# EAGLE design Board (EAGLE 9.6.2)
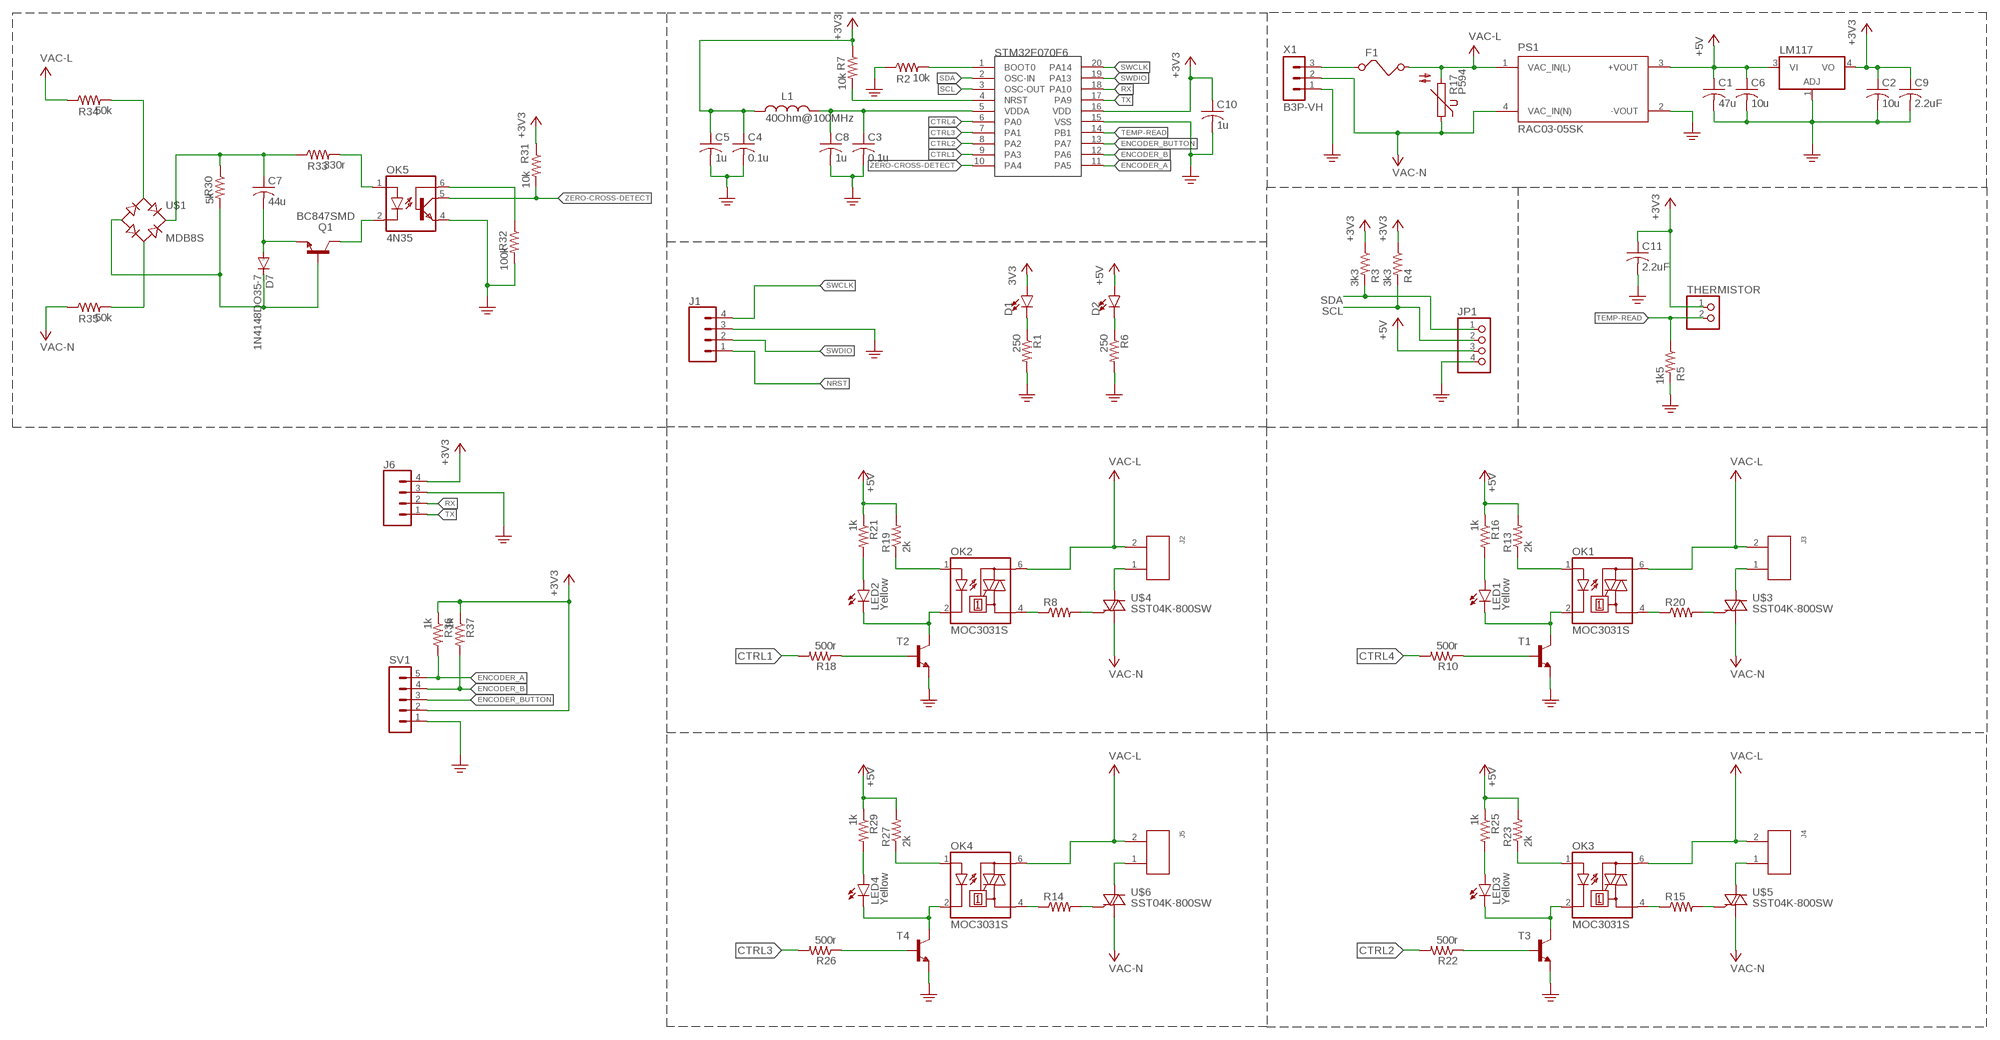
[diagram p0: schematic, sheet 1]

## Parts
C1  47u  C-USC0603  [C0603]
C2  10u  C-USC0603  [C0603]
C3  0.1u  C-USC0603  [C0603]
C4  0.1u  C-USC0603  [C0603]
C5  1u  C-USC0603  [C0603]
C6  10u  C-USC0603  [C0603]
C7  44u  C-USC0603  [C0603]
C8  1u  C-USC0603  [C0603]
C9  2.2uF  C-USC0603  [C0603]
C10  1u  C-USC0603  [C0603]
C11  2.2uF  C-USC0603  [C0603]
D1  LED0603  [LED-0603]
D2  LED0603  [LED-0603]
D7  1N4148DO35-7  [DO35-7]
F1  FUSE  [FUSE]
J1  CONN_04  [1X04]
J2  66100211622  [66100211622]
J3  66100211622  [66100211622]
J4  66100211622  [66100211622]
J5  66100211622  [66100211622]
J6  CONN_04  [1X04]
JP1  PINHD-1X4  [1X04]
L1  40Ohm@100MHz  WE-CBF_0805_74279208_WB_HS  [WE-CBF_0805(W=3.0)]
LED1  Yellow  LED-YELLOW0603  [LED-0603]
LED2  Yellow  LED-YELLOW0603  [LED-0603]
LED3  Yellow  LED-YELLOW0603  [LED-0603]
LED4  Yellow  LED-YELLOW0603  [LED-0603]
LM117  317EMP  [SOT223]
OK1  MOC3031S  [DIL6-SMD]
OK2  MOC3031S  [DIL6-SMD]
OK3  MOC3031S  [DIL6-SMD]
OK4  MOC3031S  [DIL6-SMD]
OK5  4N35  [DIL06]
PS1  RAC03-05SK  [CONV_RAC03-05SK]
Q1  BC847SMD  [SOT23]
R1  250  R-US_R0603  [R0603]
R2  10k  R-US_R0603  [R0603]
R3  3k3  R-US_R0603  [R0603]
R4  3k3  R-US_R0603  [R0603]
R5  1k5  R-US_R0603  [R0603]
R6  250  R-US_R0603  [R0603]
R7  10k  R-US_R0603  [R0603]
R8  R-US_0613/15  [P0613/15]
R10  500r  R-US_R0603  [R0603]
R13  2k  R-US_R0603  [R0603]
R14  R-US_0613/15  [P0613/15]
R15  R-US_0613/15  [P0613/15]
R16  1k  R-US_R0603  [R0603]
R17  P594  [P594]
R18  500r  R-US_R0603  [R0603]
R19  2k  R-US_R0603  [R0603]
R20  R-US_0613/15  [P0613/15]
R21  1k  R-US_R0603  [R0603]
R22  500r  R-US_R0603  [R0603]
R23  2k  R-US_R0603  [R0603]
R25  1k  R-US_R0603  [R0603]
R26  500r  R-US_R0603  [R0603]
R27  2k  R-US_R0603  [R0603]
R29  1k  R-US_R0603  [R0603]
R30  5k  R-US_R0603  [R0603]
R31  10k  R-US_R0603  [R0603]
R32  100k  R-US_R0603  [R0603]
R33  330r  R-US_R0603  [R0603]
R34  50k  R-US_R0603  [R0603]
R35  50k  R-US_R0603  [R0603]
R36  1k  R-US_R0603  [R0603]
R37  1k  R-US_R0603  [R0603]
STM32F070F6  STM32F07  [TSSOP20]
SV1  MA05-1  [MA05-1]
T1  -NPN-SOT23-EBC  [SOT23-EBC]
T2  -NPN-SOT23-EBC  [SOT23-EBC]
T3  -NPN-SOT23-EBC  [SOT23-EBC]
T4  -NPN-SOT23-EBC  [SOT23-EBC]
THERMISTOR  PINHD-1X2  [1X02]
U$1  MDB8S  [4-MICRODIP]
U$3  SST04K-800SW  [DPAK]
U$4  SST04K-800SW  [DPAK]
U$5  SST04K-800SW  [DPAK]
U$6  SST04K-800SW  [DPAK]
X1  B3P-VH  [B3P-VH]

## Nets
+3V3: C2.1 C4.1 C5.1 C9.1 C10.1 C11.1 D1.A J6.4 L1.1 LM117.4(VO) R3.1 R4.1 R7.1 R31.1 R36.1 R37.1 STM32F070F6.16(VDD) SV1.2 THERMISTOR.1 ; supply symbol labelled 3V3
+5V: C1.1 C6.1 D2.A JP1.3 LM117.3(VI) PS1.3(+VOUT) R13.2 R16.1 R19.2 R21.1 R23.2 R25.1 R27.2 R29.1
CTRL1: R18.2 STM32F070F6.9(PA3)
CTRL2: R22.2 STM32F070F6.8(PA2)
CTRL3: R26.2 STM32F070F6.7(PA1)
CTRL4: R10.2 STM32F070F6.6(PA0)
ENCODER_A: R36.2 STM32F070F6.11(PA5) SV1.5
ENCODER_B: R37.2 STM32F070F6.12(PA6) SV1.4
ENCODER_BUTTON: STM32F070F6.13(PA7) SV1.3
FET1: R18.1 T2.B
FET2: R22.1 T3.B
FET3: R10.1 T1.B
FET4: R26.1 T4.B
N$1: D1.C R1.1
N$2: D2.C R6.1
N$3: C3.1 C8.1 L1.2 STM32F070F6.5(VDDA)
N$4: LED2.C OK2.2(C) T2.C
N$5: LED1.C OK1.2(C) T1.C
N$7: OK1.4(A1) R20.1
N$8: OK1.1(A) R13.1
N$9: R20.2 U$3.3(G)
N$10: LED1.A R16.2
N$11: J3.1 U$3.4(A2)
N$12: OK2.1(A) R19.1
N$13: OK2.4(A1) R8.1
N$14: R8.2 U$4.3(G)
N$15: LED2.A R21.2
N$16: J2.1 U$4.4(A2)
N$17: LED3.C OK3.2(C) T3.C
N$18: OK3.1(A) R23.1
N$20: OK3.4(A1) R15.1
N$23: R15.2 U$5.3(G)
N$24: LED3.A R25.2
N$25: J4.1 U$5.4(A2)
N$26: LED4.C OK4.2(C) T4.C
N$27: OK4.1(A) R27.1
N$28: OK4.4(A1) R14.1
N$29: R14.2 U$6.3(G)
N$30: LED4.A R29.2
N$31: J5.1 U$6.4(A2)
N$32: D7.C Q1.1(B) R30.2 U$1.4(-)
N$33: C7.1 R30.1 R33.1 U$1.3(+)
N$34: C7.2 D7.A Q1.2(E)
N$35: OK5.2(C) Q1.3(C)
N$36: OK5.6(BAS) R32.1
N$37: OK5.1(A) R33.2
N$38: R34.2 U$1.1(AC1)
N$39: R35.2 U$1.2(AC2)
N$43: R2.2 STM32F070F6.1(BOOT0)
NRST: J1.1 R7.2 STM32F070F6.4(NRST)
PE: C1.2 C2.2 C3.2 C4.2 C5.2 C6.2 C8.2 C9.2 C10.2 C11.2 J1.3 J6.3 JP1.4 LM117.1(ADJ) OK5.4(EMI) PS1.2(-VOUT) R1.2 R2.1 R5.2 R6.2 R32.2 STM32F070F6.15(VSS) SV1.1 T1.E T2.E T3.E T4.E X1.1
RX: J6.2 STM32F070F6.18(PA10)
SCL: JP1.2 R4.2 STM32F070F6.3(OSC-OUT)
SDA: JP1.1 R3.2 STM32F070F6.2(OSC-IN)
SWCLK: J1.4 STM32F070F6.20(PA14)
SWDIO: J1.2 STM32F070F6.19(PA13)
TEMP-READ: R5.1 STM32F070F6.14(PB1) THERMISTOR.2
TX: J6.1 STM32F070F6.17(PA9)
V+: F1.2 J2.2 J3.2 J4.2 J5.2 OK1.6(A2) OK2.6(A2) OK3.6(A2) OK4.6(A2) PS1.1(VAC_IN(L)) R17.2 R34.1 ; supply symbol labelled VAC-L
V-: PS1.4(VAC_IN(N)) R17.1 R35.1 U$3.1(A1) U$4.1(A1) U$5.1(A1) U$6.1(A1) X1.2 ; supply symbol labelled VAC-N
VAC(L)-INPUT: F1.1 X1.3
ZERO-CROSS-DETECT: OK5.5(COL) R31.2 STM32F070F6.10(PA4)

## Library data of the parts
C1-C11 = rcl:C-US: CAPACITOR, American symbol; SPICEPREFIX: C
D1 D2 = SparkFun-LED:LED: LED (Generic) Standard schematic elements and footprints for 5mm, 3mm, 1206, and 0603 sized LEDs. Generic LEDs with no color specified.
D7 = diode:1N4148: DIODE high speed (Philips)
F1 = special:FUSE: FUSE 5 x 20 mm
J1 J6 = SparkFun-Connectors:CONN_04: Multi connection point. Often used as Generic Header-pin footprint for 0.1 inch spaced/style header connections On any of the 0.1 inch spaced packages, you can populate with these: Break Away Headers - Straight <https://www.sparkfun.com/products/116> (PRT-00116) Break Away Male Headers - Right Angle <https://www.sparkfun.com/products/553> (PRT-00553) Female Headers <https://www.sparkfun.com/products/115> (PRT-00115) Break Away Headers - Machine Pin <https://www.sparkfun.com/products/117> (PRT-00117) Break Away Female Headers - Swiss Machine Pin <https://www.sparkfun.com/products/743> (PRT-00743) For SCREWTERMINALS and SPRING TERMINALS visit here: Screw Terimnals on SparkFun.com <https://www.sparkfun.com/search/results?term=Screw+Terminals> (5mm/3.5mm/2.54mm spacing) This device is also useful as a general connection point to wire up your design to another part of your project. Our various solder wires solder well into these plated through hole pads. Hook-Up Wire - Assortment (Stranded, 22 AWG) <https://www.sparkfun.com/products/11375> (PRT-11375) Hook-Up Wire - Assortment (Solid Core, 22 AWG) <https://www.sparkfun.com/products/11367> (PRT-11367) View the entire wire category on our website here <https://www.sparkfun.com/categories/141> Special notes: Molex polarized connector foot print use with SKU : PRT-08231 with associated crimp pins and housings. 1MM SMD Version SKU: PRT-10208; PROD_ID: CONN-09696
J2-J5 = Wurth_Elektronik_Electromechanic_Wire_to_Board_Connectors_rev19a:66100211622: WIRE TO BOARD CONNECTION - 2.54 MM - SHROUDED HEADER - STRAIGHT - GLOW WIRE PLASTIC - WR-WTB =>ConWTB254 66100211622 Characteristics INSULATOR: PA46G15 FLAMMABILITY RATING: UL94V0 COLOR: BLACK METAL: PHOSPHOR BRONZE PLATING: TIN OVER Ni QUALITY CLASS: 25 MATING CYCLES OPERATING TEMPERATURE:-40°C UP TO +125°C COMPLIANCE: LEAD FREE AND ROHS ELECTRICAL CURRENT RATING: 3 A WORKING VOLTAGE: 50 VAC WITHSTANDING VOLTAGE: 500 VAC/MIN INSULATION RESISTANCE: >1000 MΩ CONTACT RESISTANCE: 20 mΩ MAX <http://katalog.we-online.de/media/images/v2/Family_WR-WTB_6610xx11622_2%2054.jpg> Details see: http://katalog.we-online.de/en/em/WTB_2_54_MALE_HORIZONTAL_SHROUDED_HEADER_GLOW_WIRE_PLASTIC_6610XXX1622 2015 (C) Wurth Elektronik
JP1 = pinhead:PINHD-1X4: PIN HEADER
L1 = Wurth_EMC Components_WE-CBF:WE-CBF_0805: WE-CBF SMD EMI Suppression Ferrite Bead Characteristics Reliable Ni-Sn electrodes High rated current up to 6 A Operating temperature: –55 ºC to +125 ºC Applications Perfect as data lined filter and for uncoupling of distribution voltage Package name and Variant abbreviation: Package: Wide Band /High Speed: W=Width= 3.0 High Current: W=Width= 4.0 Variant abbreviation: WB = Wide Band HS=High Speed HC=High Current <https://katalog.we-online.de/media/images/v2/o14753v209%20Family_WE-CBF.jpg> Details see: http://katalog.we-online.de/en/pbs/WE-CBF Updated by Ella Wu 2019-01-02 2019 (C) Wurth Elektronik; DATASHEET-URL: https://katalog.we-online.de/pbs/datasheet/74279208.pdf; IR1: 500mA; IR2: -; MOUNT: SMT; PART-NUMBER: 74279208; RDC-MAX: 0.15Ohm; TYPE: High Speed; Z: 69Ohm@1GMHz; ZMAX: 68Ohm
LED1-LED4 = SparkFun-LED:LED-YELLOW: Yellow SMD LED Used in manufacturing several products at SparkFun. Packages: 0603 - SMD 0603 package[Product Link] <http://www.kingbrightusa.com/product.asp?catalog_name=LED&product_id=APT1608SYCK> 0603 -SMART - SMART SMD 0603 package (more efficient/more expensive) [Product Link] <http://www.osram-os.com/osram_os/en/products/product-catalog/led-light-emitting-diodes/smartled-0603/ly-l29k/index.jsp> LilyPad - SMD1206 package[Product Datasheet] <https://www.sparkfun.com/datasheets/DevTools/LilyPad/Q150YUS4.pdf> SparkFun Products: Blynk Board <https://www.sparkfun.com/products/13794> IOIO-OTG <https://www.sparkfun.com/products/13613> XBee Explorer Serial <https://www.sparkfun.com/products/13225>; PROD_ID: DIO-09003
LM117 = linear:*317: Positive VOLTAGE REGULATOR
OK1-OK4 = optocoupler:MOC30*: 6-Pin DIP Zero-Cross Optoisolators Triac Driver Output (250/400 Volt Peak) Source: Data sheet <http://www.fairchildsemi.com/ds/MO/MOC3031M.pdf> The old path of data sheet not more available 2013-05-06.; MF: FAIRCHILD SEMICONDUCTOR; MPN: MOC3031SM; OC_FARNELL: unknown; OC_NEWARK: 34C1335
OK5 = optocoupler:4N35: MOTOROLA OPTO COUPLER; MF: FAIRCHILD SEMICONDUCTOR; MPN: 4N35; OC_FARNELL: 1328375; OC_NEWARK: 72K9946
PS1 = SousVide Library:RAC03-05SK: 3W AC/DC-Converter 'POWERLINE' 3kV reg; AVAILABILITY: Unavailable; DESCRIPTION: Enclosed AC DC Converters 1 Uitgang 5V 600mA 85 ~ 264 VAC, 120 ~ 370 VDC Input; MF: Recom Power; MP: RAC03-05SK; PACKAGE: DIP-4 Recom Power; PRICE: None
Q1 = SousVide Library:BC847*: NPN Transistor
R1-R8 R10 R13-R16 R18-R23 R25-R27 R29-R37 = rcl:R-US_: RESISTOR, American symbol; SPICEPREFIX: R
R17 = varistor:P594: VARISTOR
STM32F070F6 = SousVide Library:STM32F07
SV1 = con-lstb:MA05-1: PIN HEADER; OC_FARNELL: unknown; OC_NEWARK: unknown
T1-T4 = transistor:*-NPN-: NPN Transistror BF959 corrected 2008.03.06
THERMISTOR = pinhead:PINHD-1X2: PIN HEADER
U$1 = SousVide Library:MDB8S
U$3-U$6 = SousVide Library:SST04K-800SW
X1 = con-JST VH:B3P-VH: JST VH Series header 3.96mm pitch disconnectable crimp style connectors, vertical (side entry type), 3 pins

## Net classes
0 default: width 0.305 mm, drill 0.305 mm, clearance 0.254 mm

## Board
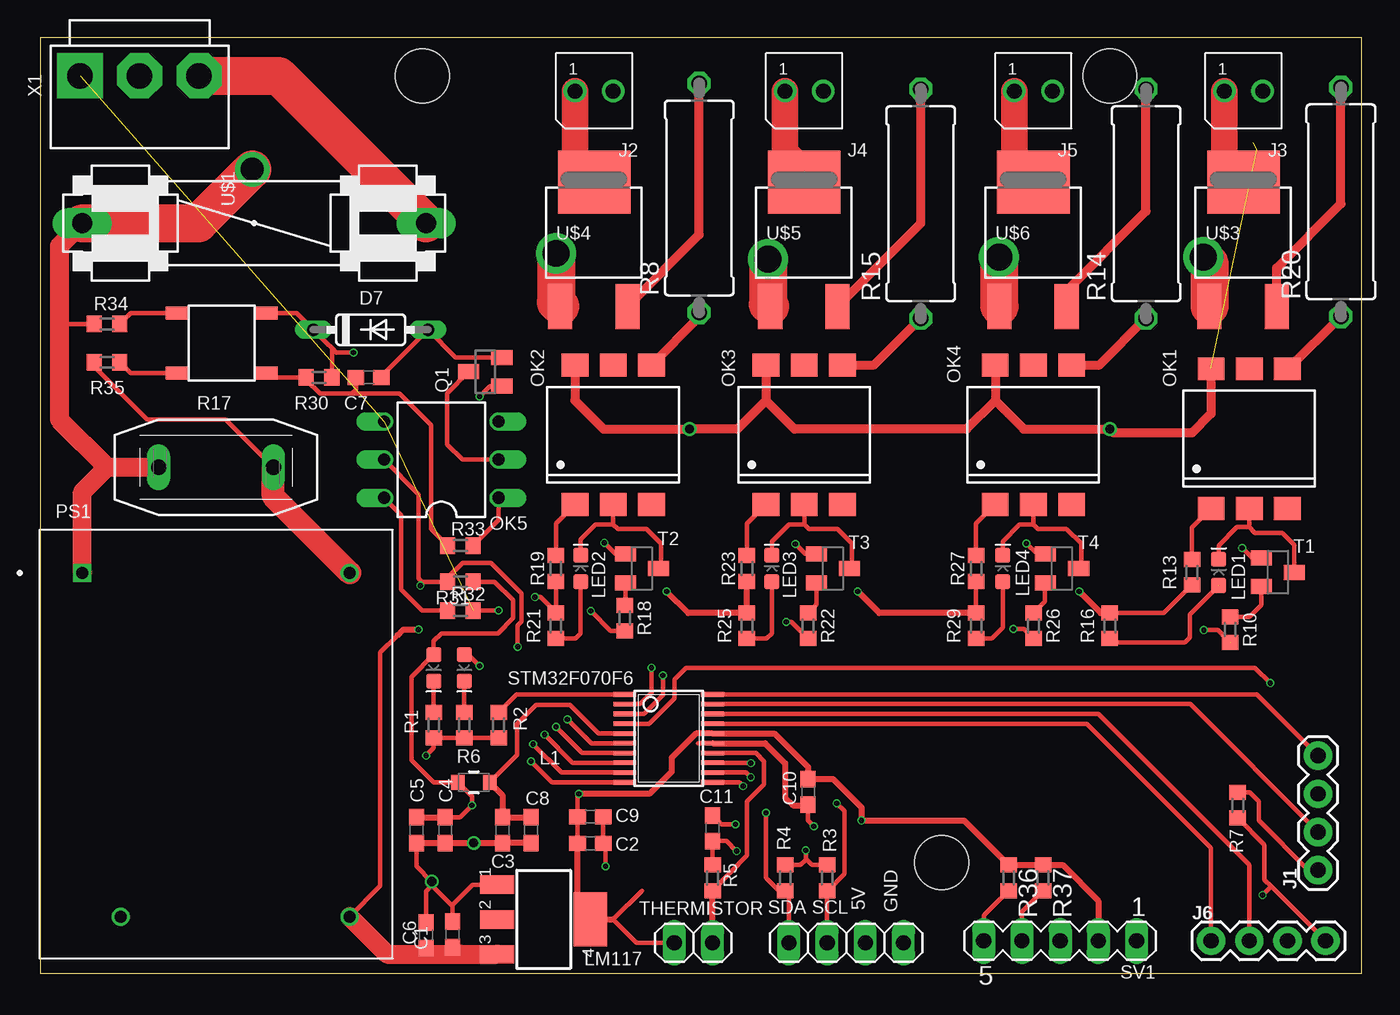
[diagram p1: board, top side]
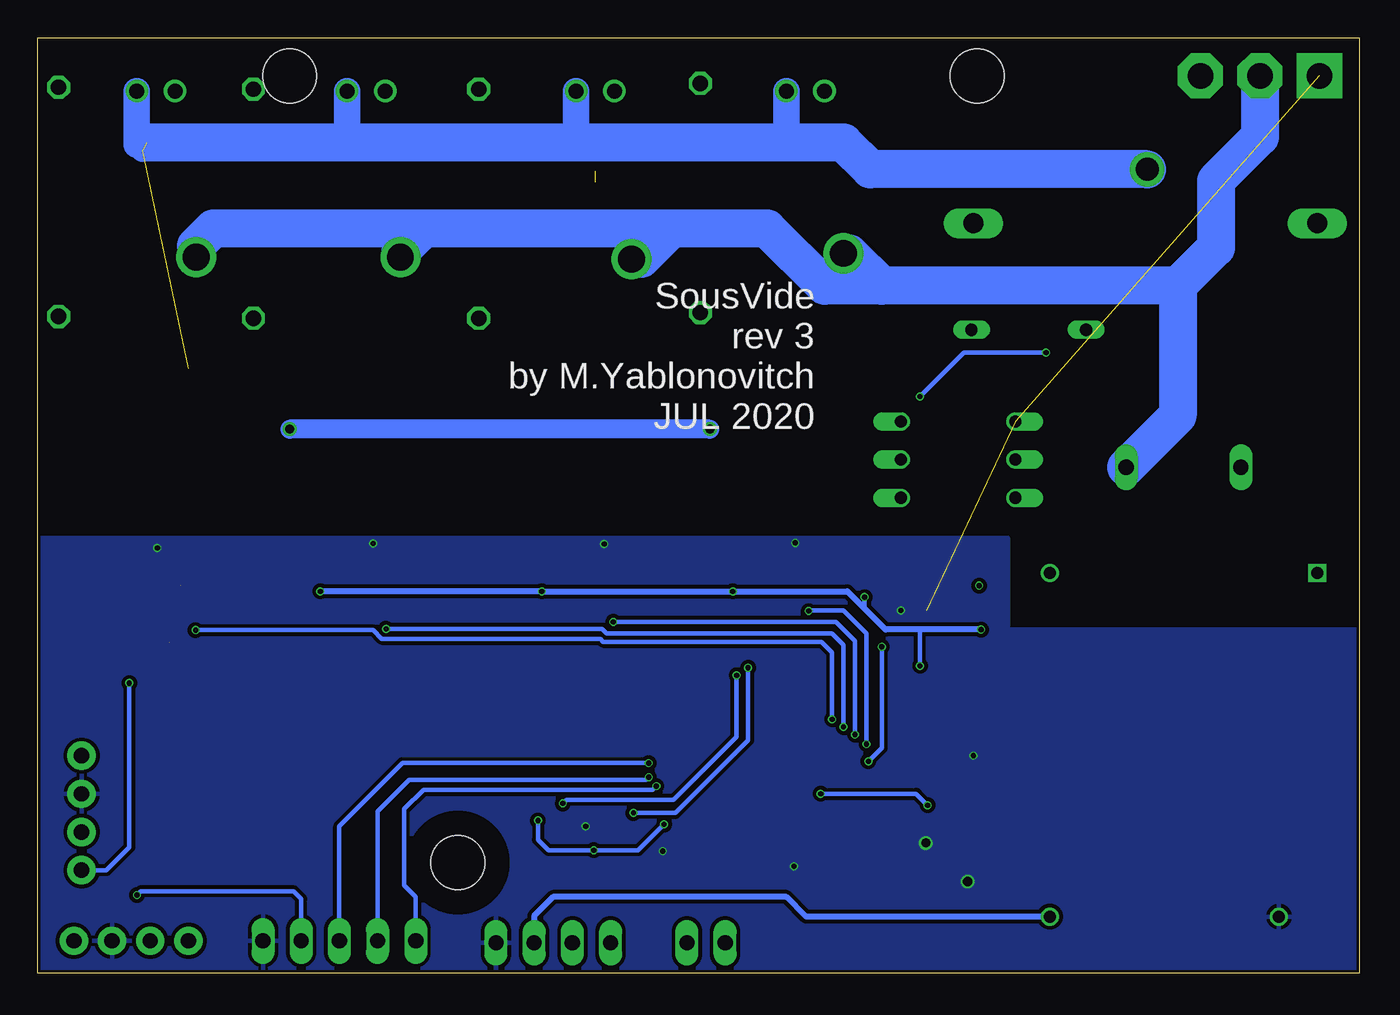
[diagram p2: board, bottom side, seen from below]

Size 87.88 x 62.23 mm. Coordinates in mm from the lower left corner, seen from the top.
Outline: 0,0 87.88,0 87.88,62.23 0,62.23 0,0
Copper layers (1*16): Top 0.035559375mm / dielectric 1.6mm / Bottom 0.035559375mm
Design rules "jlcpcb2layer *": minimum track width 5mil, minimum drill 8mil, track to track 5mil, track to pad 5mil, pad to pad 5mil, via to via 5mil, smd to smd 5mil, copper to edge 8mil, drill to drill 6mil, minimum pad ring 5mil, minimum via ring 3mil, stop-mask expansion 2.5mil, vias tented up to drill 0mil, thermal gap 10mil
Holes 3.58 mm at 71.12,59.69 25.4,59.69 59.94,7.37
bRestrict: area 22.6,56.9 to 28.2,62.5; area 68.6,57.1 to 73.7,62.2; area 57.8,5.2 to 62.1,9.5

### Footprints (pad centres in the part's own frame; a part is rotated, then mirrored left to right if it is on the bottom)
C0603 = smd 1.1 x 1: 1 -0.85,0; 2 0.85,0
LED-0603 = smd 1 x 1: A -0.877,0; C 0.877,0
DO35-7 = drill 0.813 long: A 3.81,0; C -3.81,0
FUSE = drill 1.321 long: 1 -11.43,0; 2 11.43,0
1X04 = drill 1.016 pad 1.88: 1 0,0; 2 2.54,0; 3 5.08,0; 4 7.62,0
66100211622 = drill 1: 1 1.27,0; 2 -1.27,0
1X04' = drill 1.016 long: 1 -3.81,0; 2 -1.27,0; 3 1.27,0; 4 3.81,0
WE-CBF_0805(W=3.0) = smd 0.9 x 1: 1 -1.05,0; 2 1.05,0
SOT223 = smd 1.219 x 2.235: 1 -2.311,-3.099; 2 0,-3.099; 3 2.311,-3.099 | smd 3.6 x 2.2: 4 0,3.099
DIL6-SMD = smd 1.78 x 1.52: 1 -2.54,-4.645; 2 0,-4.645; 3 2.54,-4.645; 4 2.54,4.645; 5 0,4.645; 6 -2.54,4.645
DIL06 = drill 0.813 offset: 1 -2.54,-3.81; 2 0,-3.81; 3 2.54,-3.81; 4 2.54,3.81; 5 0,3.81; 6 -2.54,3.81
CONV_RAC03-05SK = drill 0.8 pad 1.2 square: 1 -8.89,11.39 | drill 0.8 pad 1.2: 2 -6.35,-11.47; 3 8.89,-11.47; 4 8.89,11.39
SOT23 = smd 1 x 1.4: 1 -0.95,-1.1; 2 0.95,-1.1; 3 0,1.1
R0603 = smd 1 x 1.1: 1 -0.85,0; 2 0.85,0
P0613/15 = drill 1.016 octagon: 1 -7.62,0; 2 7.62,0
P594 = drill 1.016 long: 1 0,3.81; 2 0,-3.81
TSSOP20 = smd 0.305 x 1.524: 1 -2.925,-2.918; 2 -2.275,-2.918; 3 -1.625,-2.918; 4 -0.975,-2.918; 5 -0.325,-2.918; 6 0.325,-2.918; 7 0.975,-2.918; 8 1.625,-2.918; 9 2.275,-2.918; 10 2.925,-2.918; 11 2.925,2.918; 12 2.275,2.918; 13 1.625,2.918; 14 0.975,2.918; 15 0.325,2.918; 16 -0.325,2.918; 17 -0.975,2.918; 18 -1.625,2.918; 19 -2.275,2.918; 20 -2.925,2.918
MA05-1 = drill 1.016 long: 1 -5.08,0; 2 -2.54,0; 3 0,0; 4 2.54,0; 5 5.08,0
SOT23-EBC = smd 1 x 1.4: B 0.95,-1.1; C 0,1.1; E -0.95,-1.1
1X02 = drill 1.016 long: 1 -1.27,0; 2 1.27,0
4-MICRODIP = smd 0.85 x 1.55: 1 -2,-2.95; 2 2,-2.95; 3 2,2.95; 4 -2,2.95
DPAK = smd 1.6 x 2.997: 1 -2.261,-4.928; 3 2.21,-4.928 | smd 4.826 x 4.191: 4 0,3.353
B3P-VH = drill 1.7 pad 3 square: 1 -3.96,0 | drill 1.7 pad 3 octagon: 2 0,0; 3 3.96,0

### Placement (x,y rotation side)
C1  27.43,2.58 90 top
C2  36.58,8.64 0 top
C3  30.73,9.53 270 top
C4  26.92,9.53 270 top
C5  25.02,9.53 270 top
C6  25.65,2.54 90 top
C7  21.84,39.62 0 top
C8  32.64,9.53 270 top
C9  36.58,10.41 0 top
C10  51.05,12.06 270 top
C11  44.7,9.65 270 top
D1  26.16,20.32 270 top
D2  28.19,20.32 270 top
D7  21.97,42.8 0 top
F1  14.22,49.89 180 top
J1  84.96,6.86 90 top
J2  36.83,58.67 180 top
J3  80.01,58.67 180 top
J4  50.8,58.67 180 top
J5  66.04,58.67 180 top
J6  77.85,2.16 0 top
JP1  [1X04']  53.59,2.03 0 top
L1  28.83,12.7 0 top
LED1  78.36,26.67 90 top
LED2  35.94,26.92 90 top
LED3  48.64,26.92 90 top
LED4  64.01,26.92 90 top
LM117  33.48,3.58 270 top
OK1  80.39,35.56 0 top
OK2  38.1,35.81 0 top
OK3  50.8,35.81 0 top
OK4  66.04,35.81 0 top
OK5  26.67,34.16 90 top
PS1  11.68,15.24 0 top
Q1  29.59,40.01 90 top
R1  26.16,16.51 270 top
R2  30.48,16.51 90 top
R3  49.53,6.35 270 top
R4  52.32,6.35 270 top
R5  44.7,6.35 90 top
R6  28.19,16.51 270 top
R7  79.63,11.18 90 top
R8  43.81,51.56 90 top
R10  79.12,22.86 270 top
R13  76.58,26.67 270 top
R14  73.53,51.18 90 top
R15  58.55,51.18 90 top
R16  71.12,23.11 270 top
R17  11.68,33.66 270 top
R18  38.86,23.62 270 top
R19  34.29,26.92 270 top
R20  86.49,51.31 90 top
R21  34.29,23.11 270 top
R22  51.05,23.11 270 top
R23  46.99,26.92 270 top
R25  46.99,23.11 270 top
R26  66.04,23.11 270 top
R27  62.23,26.92 270 top
R29  62.23,23.11 270 top
R30  18.54,39.62 0 top
R31  27.94,26.04 180 top
R32  27.94,24.13 0 top
R33  27.94,28.45 0 top
R34  4.45,43.18 0 top
R35  4.45,40.64 0 top
R36  64.39,6.35 270 top
R37  66.67,6.35 270 top
STM32F070F6  41.79,15.62 270 top
SV1  67.82,2.16 180 top
T1  82.3,26.67 270 top
T2  40.01,26.92 270 top
T3  52.7,26.92 270 top
T4  67.94,26.92 270 top
THERMISTOR  43.43,2.03 0 top
U$1  12.06,41.91 270 top
U$3  80.01,49.28 0 top
U$4  36.83,49.28 0 top
U$5  50.8,49.28 0 top
U$6  66.04,49.28 0 top
X1  6.6,59.69 0 top

### Tracks (layer width: path | path; a pad name or v marks a point on that pad's centre or on a via)
+3V3  (via drill 0.35)
  Top 0.305: R31.1 30.23,26.04 31.44,24.82 31.44,23.63 30.43,22.61 26.68,22.61 26.16,22.1 D1.A 24.69,19.73 24.69,14.17 26.16,12.7 L1.1 28.7,11.78 v28.7,11.18 27.9,10.38 C4.1 | R4.1 51.31,7.2 50.9,7.61 v50.9,8.18 50.9,7.55 50.55,7.2 R3.1 | v35.81,11.94 35.73,11.85 C9.1 C2.1 | 40.02,5.5 38.1,3.58 39.65,2.03 THERMISTOR.1 | C11.1 45.3,9.91 v46.23,9.91 | J6.4 81.85,5.78 | 81.85,5.78 81.41,6.22 81.41,8.55 R7.1 | v81.28,5.21 81.85,5.78
  Top 0.406: C5.1 C4.1 | 38.1,3.58 LM117.4 35.73,4.43 C2.1 | v35.81,11.94 40.52,11.94 41.99,13.4 41.99,14.33 43.61,15.95 STM32F070F6.16 48.82,15.95 51.05,13.72 C10.1 52.72,12.91 54.61,11.02 v54.61,10.16 61.43,10.16 R36.1 R37.1 67.98,7.2 70.36,4.83 SV1.2
  Bottom 0.305: v35.81,11.94 29.46,11.94 v28.7,11.18 | v46.23,9.91 47.95,8.18 v50.9,8.18 53.9,8.18 54.61,8.89 v54.61,10.16 | SV1.2 70.36,4.95 70.87,5.46 81.03,5.46 v81.28,5.21
+5V  (via drill 0.35)
  Top 0.305: R21.1 34.29,24.13 | 34.29,24.13 R19.2 | R13.2 74.72,23.96 R16.1 | R29.1 R27.2 | C6.1 25.4,1.44 25.4,1.27 | C1.1 27.48,1.73 27.94,1.27 | PS1.3 22.61,5.8 22.61,21.34 23.75,22.48 | D2.A 28.46,21.2 v29.21,20.45 | 34.29,24.13 34.16,24.13 33.27,25.02 v32.89,25.02
  Top 0.406: R23.2 R25.1 43.09,23.96 v41.66,25.4 | R29.1 55.79,23.96 v54.36,25.4 | R16.1 70.52,23.96 v69.09,25.4 | 23.75,22.48 24.13,22.86 v25.15,22.86
  Top 1.27: PS1.3 23.07,1.27 25.4,1.27 27.94,1.27 LM117.3
  Bottom 0.305: 32.89,24.26 v32.89,25.02 | v29.21,20.45 29.21,22.86
  Bottom 0.406: v69.09,25.4 v54.36,25.4 v41.66,25.4 34.04,25.4 32.89,24.26 31.5,22.86 29.21,22.86 v25.15,22.86 | PS1.3 36.79,3.77 38.1,5.08 53.59,5.08 54.86,3.81 JP1.3
CTRL1  (via drill 0.35)
  Top 0.305: STM32F070F6.9 34.66,13.35 v32.77,15.24 | v36.61,24.09 37.93,22.77 R18.2
  Bottom 0.305: v32.77,15.24 32.77,22.61 34.29,24.13 36.58,24.13 v36.61,24.09
CTRL2  (via drill 0.35)
  Top 0.305: STM32F070F6.8 35.4,14 v33.53,15.88 | R22.2 49.95,23.37 v49.6,23.37
  Bottom 0.305: v33.53,15.88 33.53,22.1 34.8,23.37 v49.6,23.37
CTRL3  (via drill 0.35)  (1 unrouted)
  Top 0.305: STM32F070F6.7 36.02,14.65 v34.29,16.38 | R26.2 65.4,22.91 v64.72,22.91
  Bottom 0.305: v34.29,16.38 34.29,21.84 35.05,22.61 50.04,22.61 50.34,22.91 v64.72,22.91
CTRL4  (via drill 0.35)  (2 unrouted)
  Top 0.305: STM32F070F6.6 36.64,15.3 v35.05,16.89 | R10.2 78.31,22.82 v77.38,22.82
  Bottom 0.305: v35.05,16.89 35.05,21.34 35.76,22.05 50.27,22.05 50.47,22.24 64.99,22.24 65.58,22.82 v77.38,22.82
ENCODER_A  (via drill 0.35)
  Top 0.305: SV1.5 62.74,3.85 R36.2 | STM32F070F6.11 46.48,12.7 v46.74,12.45
  Bottom 0.305: v46.74,12.45 46.99,12.19 62.23,12.19 63.5,10.92 63.5,8.88 63.52,8.85 63.52,5.87 62.74,5.08 SV1.5
ENCODER_B  (via drill 0.35)
  Top 0.305: SV1.4 65.28,4.1 R37.2 | STM32F070F6.12 46.94,13.35 v47.24,13.04
  Bottom 0.305: v47.24,13.04 47.42,12.86 63.18,12.86 63.42,12.62 63.75,12.29 65.28,10.76 SV1.4
ENCODER_BUTTON  (via drill 0.35)
  Top 0.305: STM32F070F6.13 47.23,14 v47.25,13.98
  Bottom 0.305: SV1.3 67.82,9.78 63.62,13.98 v47.25,13.98
FET1
  Top 0.305: T2.B 38.91,24.52 R18.1
FET2
  Top 0.305: R22.1 51.6,24.52 T3.B
FET3
  Top 0.305: T1.B 81.2,24.51 80.39,23.71 R10.1
FET4
  Top 0.305: T4.B 66.79,25.92 66.79,24.71 R26.1
N$1
  Top 0.305: R1.1 D1.C
N$2
  Top 0.305: R6.1 D2.C
N$3
  Top 0.305: STM32F070F6.5 37.14,15.95 35.22,17.86 32.98,17.86 31.69,16.58 31.69,14.51 L1.2
  Top 0.406: L1.2 30.73,11.85 C3.1 C8.1
N$4
  Top 0.305: OK2.2 38.1,29.84 | 38.1,29.84 38.4,29.54 40.31,29.54 41.27,28.57 41.27,27.09 T2.C | 38.1,29.84 36.93,29.84 35.94,28.86 LED2.C
N$5
  Top 0.305: T1.C 83.4,28.49 82.6,29.29 80.77,29.29 80.39,29.67 | 80.39,29.67 OK1.2 | LED1.C 78.36,28.45 79.58,29.67 80.39,29.67
N$7
  Top 0.61: OK1.4 83,40.2 R20.1
N$8
  Top 0.305: R13.1 76.58,29.64 OK1.1
N$9
  Top 0.61: U$3.3 82.22,46.91 86.49,51.18 R20.2
N$10  (1 unrouted)
  Top 0.305: R16.2 71.37,22.01 76.11,22.01 76.45,22.35 76.45,23.88 LED1.A
N$11
  Top 1.778: J3.1 78.74,53.9 U$3.4
N$12
  Top 0.305: R19.1 34.29,29.9 OK2.1
N$13
  Top 0.61: OK2.4 43.81,43.63 R8.1
N$14
  Top 0.61: U$4.3 43.81,49.12 R8.2
N$15
  Top 0.305: R21.2 35.6,22.26 35.94,22.61 LED2.A
N$16
  Top 1.778: J2.1 35.56,53.9 U$4.4
N$17
  Top 0.305: OK3.2 50.8,29.84 | 50.8,29.84 51.1,29.54 53.01,29.54 53.98,28.57 53.98,27.09 T3.C | LED3.C 48.64,28.7 49.78,29.84 50.8,29.84
N$18
  Top 0.305: R23.1 46.99,29.9 OK3.1
N$20
  Top 0.61: OK3.4 55.45,40.46 R15.1
N$23
  Top 0.61: U$5.3 58.55,49.89 R15.2
N$24
  Top 0.305: R25.2 48.3,22.26 48.64,22.61 LED3.A
N$25  (1 unrouted)
  Top 1.778: J4.1 49.53,54.61 50.8,53.34
N$26
  Top 0.305: OK4.2 66.04,29.84 | 66.04,29.84 66.34,29.54 68.25,29.54 69.22,28.57 69.22,27.09 T4.C | LED4.C 64.01,28.73 65.12,29.84 66.04,29.84
N$27
  Top 0.305: R27.1 62.23,29.9 OK4.1
N$28
  Top 0.61: OK4.4 70.43,40.46 R14.1
N$29
  Top 0.61: U$6.3 68.25,45.39 73.53,50.67 R14.2
N$30
  Top 0.305: R29.2 63.28,22.26 64.01,22.99 LED4.A
N$31
  Top 1.778: J5.1 64.77,53.9 U$6.4
N$32  (via drill 0.35)
  Top 0.305: U$1.4 17.05,43.91 D7.C 19.05,41.91 19.39,41.57 | 19.39,41.57 R30.2 | 19.39,41.57 19.68,41.27 v20.83,41.27 | v29.21,38.35 29.91,39.05 Q1.1
  Bottom 0.305: v20.83,41.27 26.29,41.27 v29.21,38.35
N$33
  Top 0.305: U$1.3 15.3,39.62 R30.1 17.69,39.46 18.61,38.54 20.7,38.54 | R33.1 25.98,29.55 25.98,36.45 23.89,38.54 20.7,38.54 | C7.1 20.99,38.83 20.7,38.54
N$34
  Top 0.305: Q1.2 27.62,40.95 D7.A 22.69,39.71 C7.2
N$35
  Top 0.305: Q1.3 27.05,38.56 27.05,35.18 28.07,34.16 OK5.2
N$36
  Top 0.305: OK5.6 24,30.48 24,25.53 25.4,24.13 R32.1
N$37
  Top 0.305: R33.2 30.48,30.14 OK5.1
N$38
  Top 0.305: R34.2 6.03,43.91 U$1.1
N$39
  Top 0.305: R35.2 6.03,39.91 U$1.2
N$43
  Top 0.305: STM32F070F6.1 31.67,18.55 R2.2
NRST  (via drill 0.35)
  Top 0.305: STM32F070F6.4 40.48,16.6 42.16,18.29 42.16,19.56 42.93,20.32 80.77,20.32 v81.79,19.3 | J1.1 84.33,6.86 81.03,10.16 81.03,11.43 80.43,12.03 R7.2
  Bottom 0.305: v81.79,19.3 81.79,8.38 83.31,6.86 J1.1
PE  (via drill 0.35, 0.6, 0.61)  (3 unrouted)
  Top 0.305: R32.2 v30.48,24.13 | LM117.1 28.75,5.89 27.43,4.57 27.43,4.45 | C1.2 27.43,4.45 | 26.04,5.84 27.43,4.45 | C6.2 25.65,5.46 26.04,5.84 | 26.04,5.84 v26.04,6.1 25.02,7.11 C5.2 | 37.51,10.5 C9.2 C2.2 37.59,8.47 v37.59,7.11 | R2.1 R6.2 R1.2 26.16,14.99 v25.65,14.48 | T4.E 66.29,27.87 v65.58,28.59 | T1.E 80.59,27.62 v79.92,28.29 | T3.E 50.88,27.87 v50.2,28.55 | T2.E 38.26,27.87 v37.51,28.63 | R5.2 C11.2 45.64,8.8 v46.31,8.13 | STM32F070F6.15 43.75,15.3 | C10.2 51.05,10.16 v51.44,9.78
  Top 0.406: C5.2 C4.2 v28.83,8.68 C3.2 C8.2 | STM32F070F6.15 48.2,15.3 49.53,13.97 49.53,11.68 50.04,11.18 51.02,11.18 C10.2
  pour Bottom: -2.54,-1.27 -2.54,22.86 23.37,22.86 23.37,28.96 89.28,28.96 89.28,-1.27
RX
  Top 0.305: STM32F070F6.18 70.36,17.25 80.39,7.22 J6.2
SCL  (via drill 0.35)
  Top 0.305: STM32F070F6.3 40.13,17.25 41.4,18.52 v41.4,19.81 | v52.96,11.3 53.47,10.79 53.47,6.6 52.36,5.5 R4.2 JP1.2
  Bottom 0.305: v41.4,19.81 41.4,15.73 45.59,11.55 52.71,11.55 v52.96,11.3
SDA  (via drill 0.35)
  Top 0.305: v40.64,20.32 40.64,18.66 39.88,17.9 STM32F070F6.2 | JP1.1 49.78,5.25 R3.2 49.11,5.5 48.26,6.35 v48.26,10.67
  Bottom 0.305: v40.64,20.32 40.64,15.49 45.47,10.67 v48.26,10.67
SWCLK
  Top 0.305: STM32F070F6.20 80.89,18.55 J1.4
SWDIO
  Top 0.305: J1.2 76.46,17.9 STM32F070F6.19
TEMP-READ
  Top 0.305: R5.1 46.98,7.85 46.98,11.42 48.13,12.57 48.13,14.1 47.58,14.65 STM32F070F6.14
  Top 0.406: THERMISTOR.2 R5.1
TX
  Top 0.305: STM32F070F6.17 69.6,16.6 77.85,8.35 J6.1
V+  (via drill 0.61, 1.52)  (3 unrouted)
  Top 0.305: R34.1 1.27,43.18
  Top 0.61: OK4.6 63.5,38.1 | 63.5,38.1 65.41,36.2 v71.12,36.2 71.37,35.94 76.58,35.94 77.85,37.21 OK1.6 | 63.5,38.1 61.59,36.2 50.16,36.2 48.26,38.1 | OK3.6 48.26,38.1 | 48.26,38.1 46.35,36.2 v43.18,36.2 37.47,36.2 35.56,38.1 OK2.6
  Top 1.27: F1.2 1.27,48.36 1.27,43.18 1.27,36.83 4.45,33.66 | 4.45,33.66 R17.2 | PS1.1 2.79,32 4.45,33.66
  Top 2.54: F1.2 10.52,49.89 v14.1,53.47
  Bottom 1.27: v43.18,36.2 v71.12,36.2
  Bottom 1.524: 81.28,55.12 80.9,54.74
  Bottom 1.778: J2.2 38.1,55.37 37.97,55.24 | J4.2 52.07,55.24 | J5.2 67.31,55.88 66.67,55.24 | J3.2 81.28,55.12
  Bottom 2.54: v14.1,53.47 32.51,53.47 34.29,55.24 37.97,55.24 52.07,55.24 66.67,55.24 80.64,55.24
V-  (via drill 1.78)
  Top 0.305: R17.1 12.32,36.83 7.11,36.83 3.6,40.35 R35.1
  Top 1.524: PS1.4 15.49,31.71 R17.1
  Top 2.54: v34.29,47.88 34.29,44.63 U$4.1 | v48.39,47.5 48.39,44.5 U$5.1 | v63.75,47.62 63.75,44.37 U$6.1 | v77.34,47.62 77.75,47.22 U$3.1
  Bottom 1.27: 9.53,52.07 9.53,52.7
  Bottom 1.778: 9.53,52.07 9.53,48.26
  Bottom 2.54: X1.2 6.6,55.63 9.53,52.7 9.53,48.26 12.06,45.72 | 12.06,45.72 12.06,37.08 R17.1 | 12.06,45.72 31.75,45.72 | 31.75,45.72 35.56,45.72 39.37,49.53 45.72,49.53 | 45.72,49.53 62.23,49.53 | 62.23,49.53 76.2,49.53 77.34,48.39 v77.34,47.62 | 31.75,45.72 33.91,47.88 v34.29,47.88 | 45.72,49.53 47.75,47.5 v48.39,47.5 | 62.23,49.53 63.75,48.01 v63.75,47.62
VAC(L)-INPUT
  Top 2.54: X1.3 15.85,59.69 F1.1
ZERO-CROSS-DETECT  (via drill 0.35)
  Top 0.305: OK5.5 25.17,31.85 25.17,26.26 25.4,26.04 | 25.4,26.04 R31.2 27.09,26.33 28.07,27.3 29.97,27.3 32,25.27 32,23.39 31.75,23.14 v31.75,21.72 | STM32F070F6.10 34.04,12.7 v32.64,14.1 | v25.27,25.78 25.27,25.91 25.4,26.04
  Bottom 0.305: v32.64,14.1 31.75,14.99 v31.75,21.72

### Text on the board
tPlace: SDA | SCL | 5V | GND
bPlace: SousVide / rev 3 / by M.Yablonovitch / JUL 2020